# Altium schematic sheet main.SchDoc
size A4; Date: 08.06.2024; ApprovedBy: mgr inż. Jan Macheta; Author: Mikołaj Pichita; CompanyName: AGH University of Science and Technology; SheetNumber: 1; SheetTotal: 8
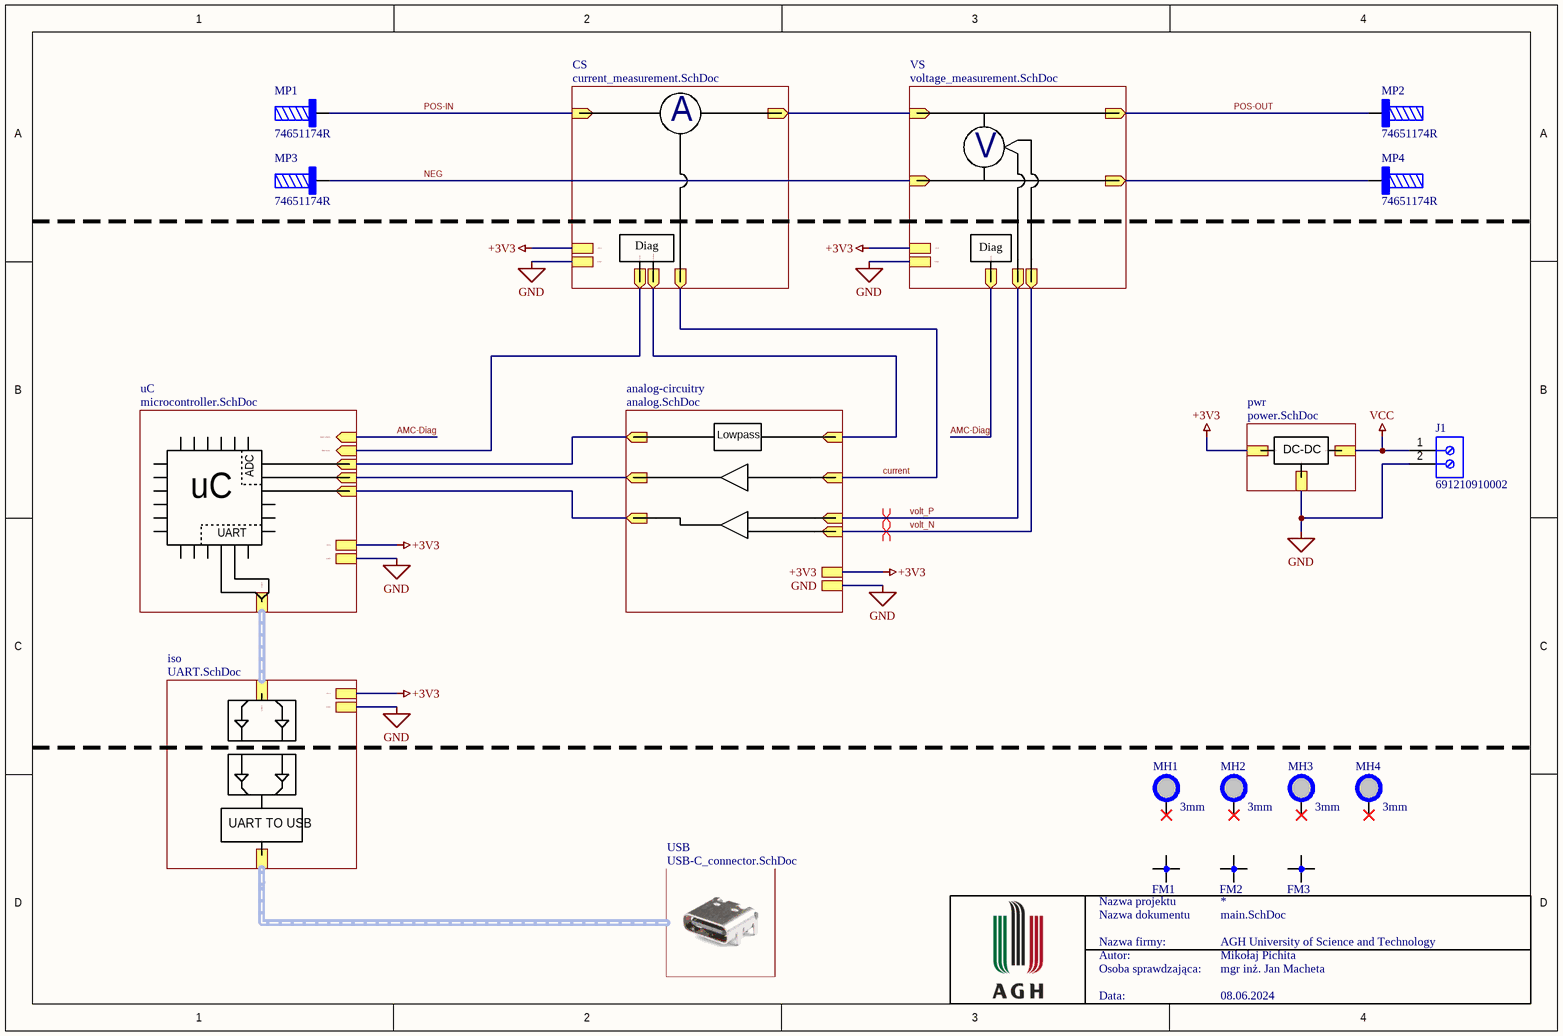
[diagram p0: main.SchDoc]

## Parts
FM1  *  [FIDUCIAL_MARKER]  (value not drawn)
FM2  *  [FIDUCIAL_MARKER]  (value not drawn)
FM3  *  [FIDUCIAL_MARKER]  (value not drawn)
J1  691210910002  [691210910002]
MH1  3mm  [MountingHole]  (no BOM)
MH2  3mm  [MountingHole]  (no BOM)
MH3  3mm  [MountingHole]  (no BOM)
MH4  3mm  [MountingHole]  (no BOM)
MP1  74651174R  [74651174]
MP2  74651174R  [74651174]
MP3  74651174R  [74651174]
MP4  74651174R  [74651174]

## Sub-sheets
analog-circuitry = analog.SchDoc: +3V3, GND, Voltage (out), Current (out), Alert-Filtered (out), TMCS-Alert (in), v_P (in), v_N (in), sensor_current (in)
CS = current_measurement.SchDoc: +IN (in), +OUT (out), GND, current (out), +3V3, TMCS-OC (out), TMCS-Alert (out)
iso = UART.SchDoc: UART (harness UART), USB (harness *), +3V3, GND
pwr = power.SchDoc: VCC, GND, +3V3
uC = microcontroller.SchDoc: GND, +3V3, AMC-DIAG (in), UART (harness UART), ADC-IN7 (in), ADC-IN9 (in), ADC-IN0 (in), TMCS-OC (in)
USB = USB-C_connector.SchDoc: USB (harness *)
VS = voltage_measurement.SchDoc: +IN (in), -IN (in), +OUT (out), -OUT (out), GND, +3V3, voltageP (out), voltageN (out), diagnostic (out)

## Nets
+3V3: sheet CS/+3V3, sheet VS/+3V3, sheet uC/+3V3, sheet iso/+3V3, sheet pwr/+3V3, sheet analog-circuitry/+3V3
GND: J1.2 ; sheet CS/GND, sheet VS/GND, sheet uC/GND, sheet iso/GND, sheet pwr/GND, sheet analog-circuitry/GND
VCC: J1.1 ; sheet pwr/VCC
AMC-Diag: sheet VS/diagnostic, sheet uC/AMC-DIAG
current: sheet CS/current, sheet analog-circuitry/sensor_current
NEG: MP3.1 ; sheet VS/-IN
POS-IN: MP1.1 ; sheet CS/+IN
POS-OUT: MP2.1 ; sheet VS/+OUT
volt_N: sheet VS/voltageN, sheet analog-circuitry/v_N
volt_P: sheet VS/voltageP, sheet analog-circuitry/v_P
NetMP4_1: MP4.1 ; sheet VS/-OUT
(unnamed): sheet CS/+OUT, sheet VS/+IN
(unnamed): sheet CS/TMCS-OC, sheet uC/TMCS-OC
(unnamed): sheet CS/TMCS-Alert, sheet analog-circuitry/TMCS-Alert
(unnamed): sheet uC/ADC-IN7, sheet analog-circuitry/Current
(unnamed): sheet uC/ADC-IN9, sheet analog-circuitry/Voltage
(unnamed): sheet uC/ADC-IN0, sheet analog-circuitry/Alert-Filtered

Not connected (* = marked no-connect by the designer): MH1 1*; MH2 1*; MH3 1*; MH4 1*

## Buses and harness runs
harness sheet iso/UART = sheet uC/UART
harness sheet iso/USB = sheet USB/USB

## Layout directives
differential pair: volt_N, volt_P

## Notes on the sheet
- A
- V
- Diag
- Lowpass
- uC
- ADC
- DC-DC
- UART
- UART TO USB
- Nazwa projektu
- Nazwa dokumentu
- Nazwa firmy:
- Autor:
- Osoba sprawdzająca:
- Data:

## Library data of the parts
FM1-FM3 = Fiducial marker: Value: *; HelpURL: *; MPN: *; Supplier: *; SupplierPartNumber: *
J1 = 691210910002: NexarPartId: 105950649; Current Rating: 6A; Voltage Rating: 150V; Number of Contacts: 2; Number of Rows: 1; Contact Material: Tin; Height: 8.7mm; Max Operating Temperature: 105°C; Min Operating Temperature: -40°C
MH1-MH4 = Mounting hole: Value: *; HelpURL: *; MPN: *; Supplier: *; SupplierPartNumber: *
MP1-MP4 = 74651174R: 74651174R Shank, THR, external thread, 7mm W x 8.5mm H, M4, 4 Pins | Wurth Electronics 74651174R; NexarPartId: 78872243; Current Rating: 50A; Material: Brass; Packaging: Tape and Reel; Height: 8.5mm; Max Operating Temperature: 150°C; RoHS: Compliant; Width: 7mm; Min Operating Temperature: -55°C; Number of Pins: 4